# EAGLE board GETEWAY (EAGLE 9.5.1), part 1 of 2
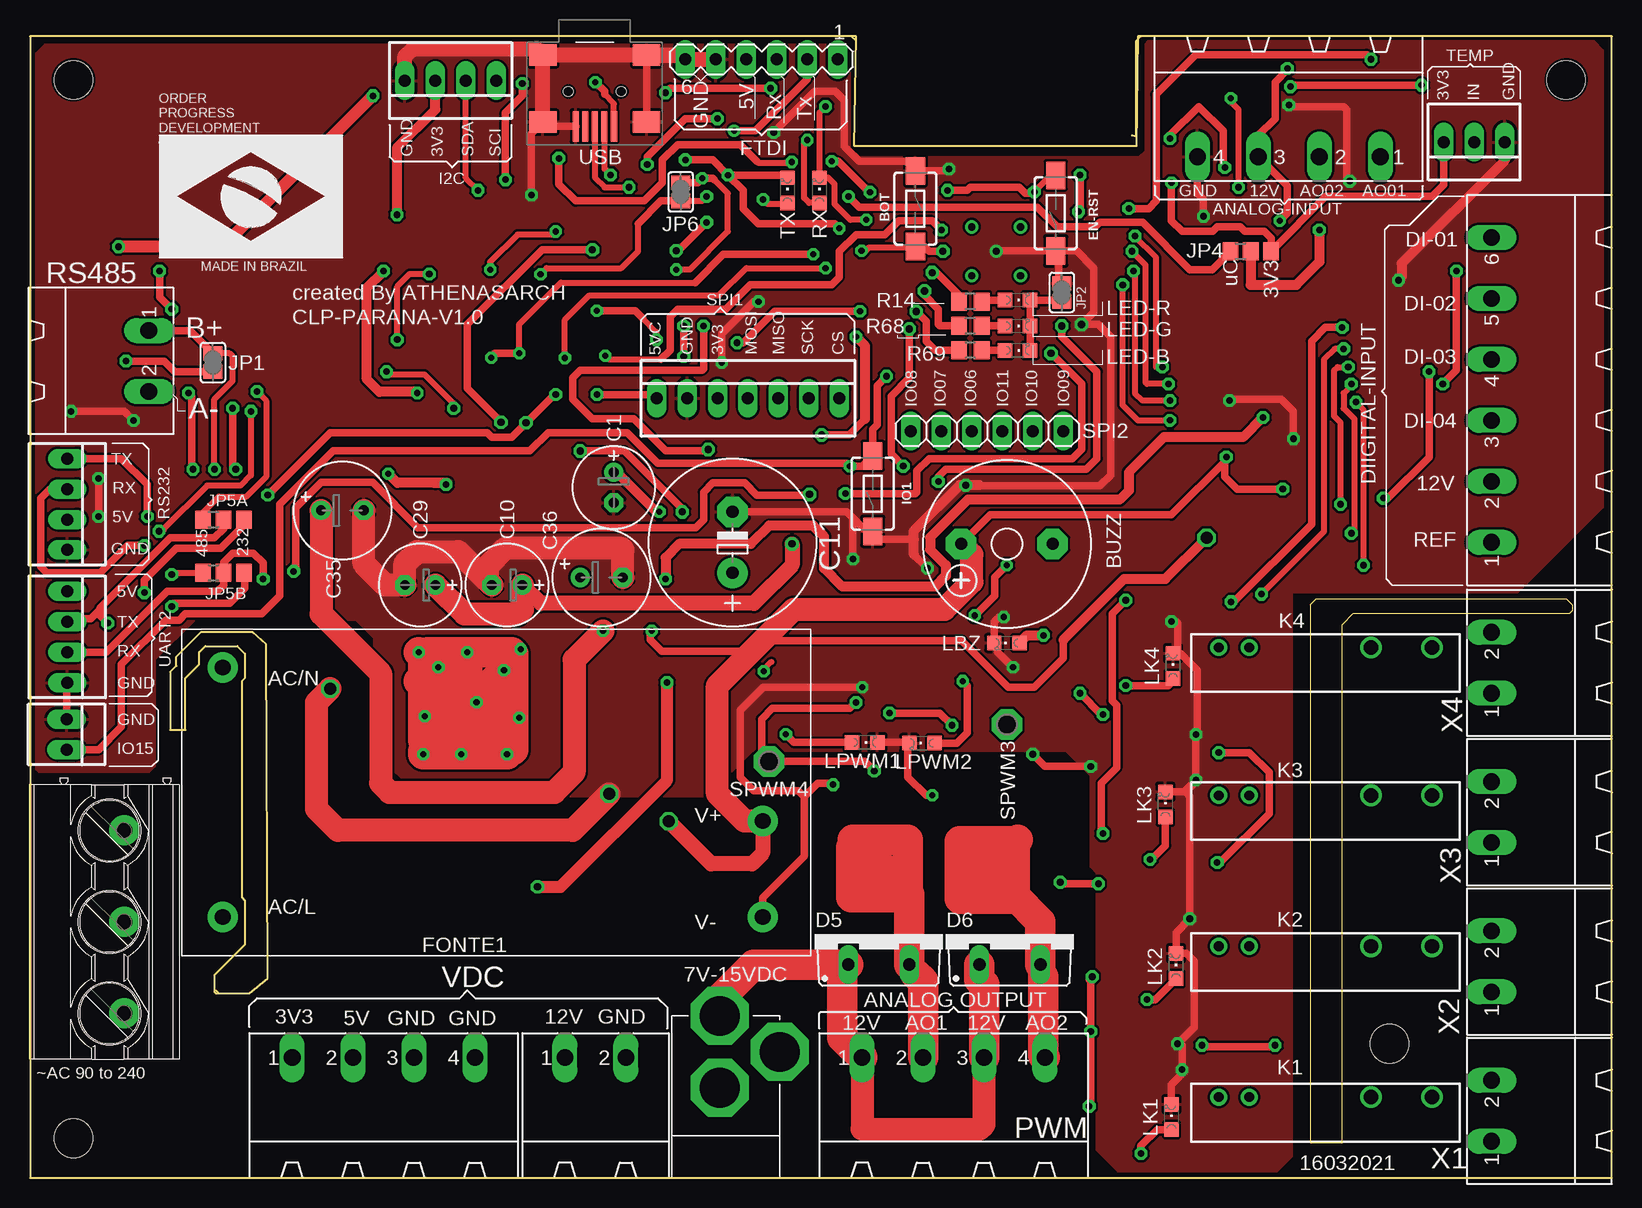
[diagram p5: board, top side]
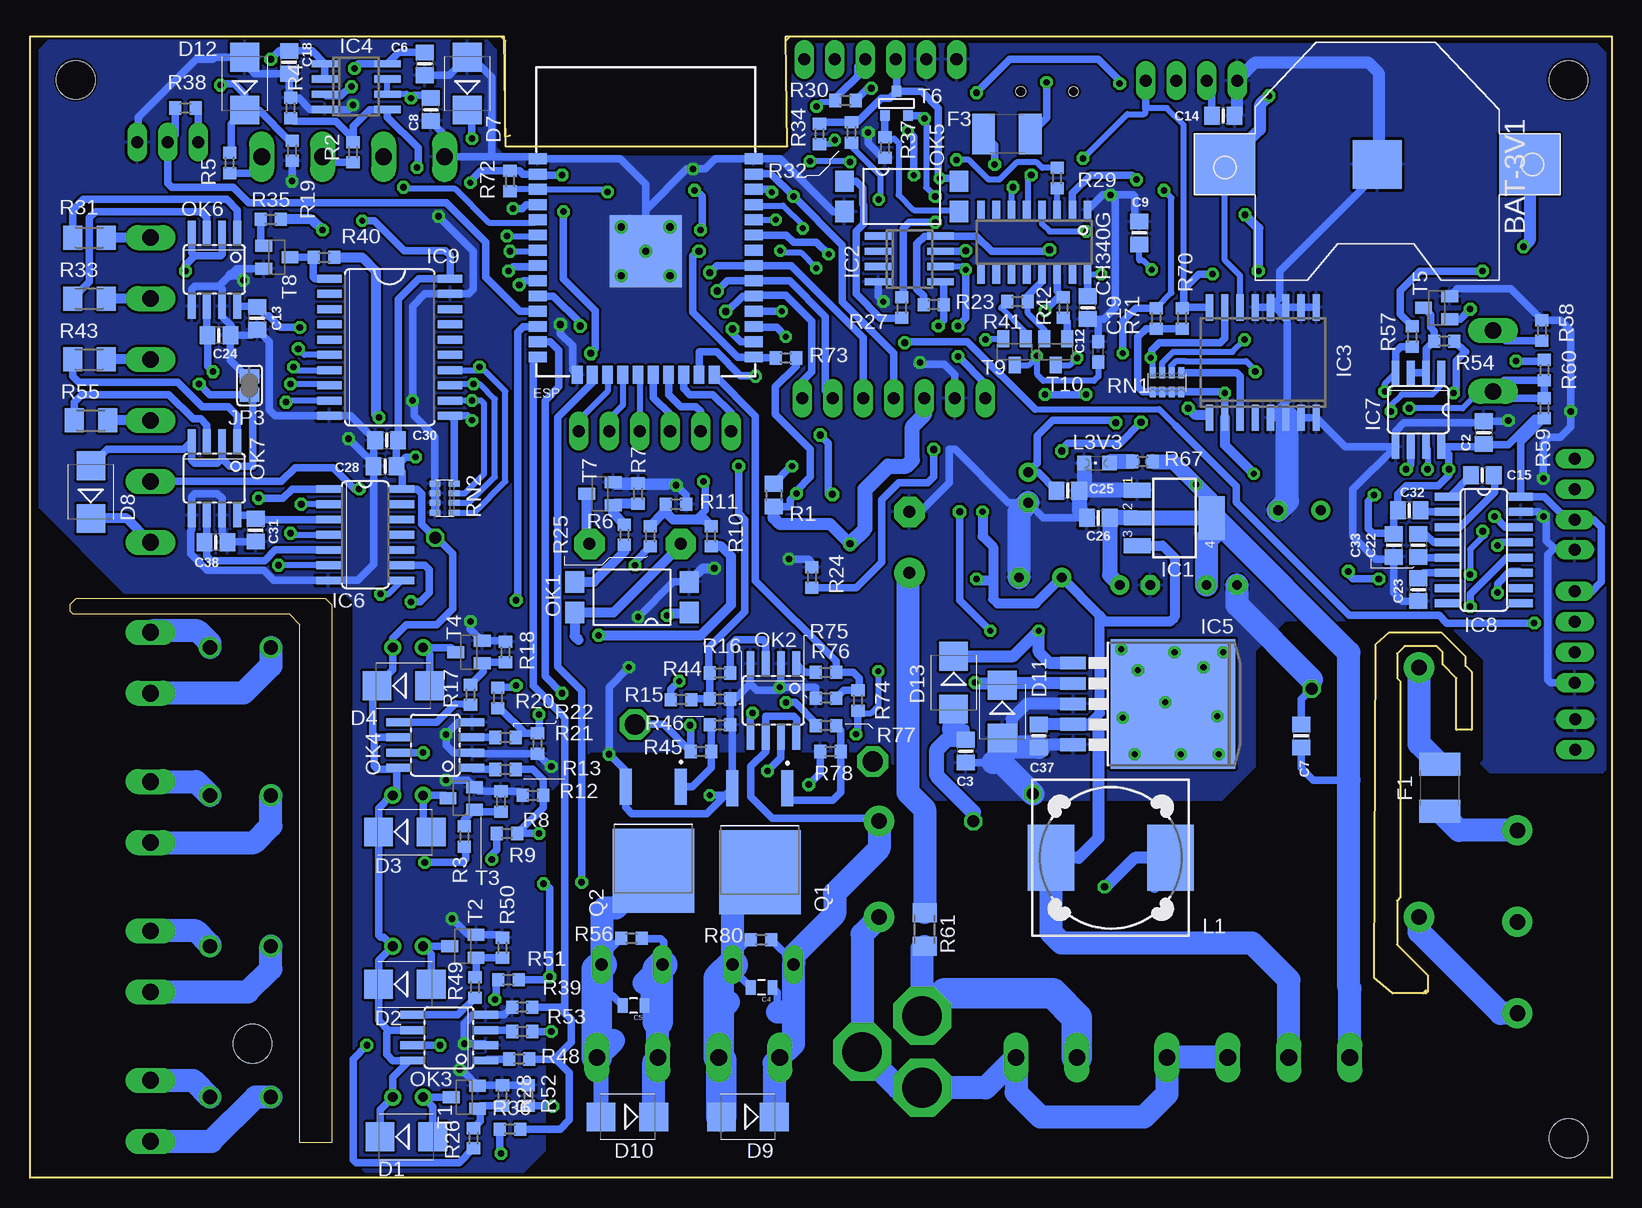
[diagram p6: board, bottom side, seen from below]

Size 131.83 x 95.12 mm. Coordinates in mm from the lower left corner, seen from the top.
Outline: 15.75,15.37 18.29,15.37 19.81,16.64 19.68,44.45 18.54,45.47 14.22,45.47 12.19,43.43 12.19,42.67 11.68,42.16 11.68,37.34 12.95,37.34 12.95,41.66 14.1,42.8 14.1,43.81 14.61,44.32 17.27,44.32 17.91,43.69 17.91,41.66 17.65,41.4 17.65,23.37 17.91,23.11 17.91,19.43 15.37,16.89 15.37,15.49 15.49,15.37 15.75,15.37
Outline: 15.49,15.62 15.75,15.37
Outline: 91.82,86.87 92.2,86.74 92.2,94.74 92.58,95.12
Outline: 68.83,94.74 68.45,95.12
Outline: 109.35,2.92 109.35,46.1 110.24,46.99 128.27,46.99 128.52,47.24 128.52,47.75 128.02,48.26 107.19,48.26 106.68,47.75 106.68,2.92 109.35,2.92
Outline: 131.83,0 131.83,95.12 92.33,95.12 92.2,85.98 68.71,85.98 68.83,95.12 0,95.12 0,0 131.83,0
Copper layers (1*16): Top 0.035mm / dielectric 1.5mm / Bottom 0.035mm
Design rules "SparkFun": minimum track width 8mil, minimum drill 20mil, track to track 8mil, track to pad 8mil, pad to pad 8mil, via to via 8mil, smd to smd 8mil, copper to edge 8mil, drill to drill 8mil, minimum pad ring 12mil, minimum via ring 10mil, stop-mask expansion 4mil, vias tented up to drill 20mil, thermal gap 10mil
Net classes: 1 power: width 0.61 mm, drill 0.406 mm, clearance 0.203 mm; 2 vcc: width 0.406 mm, drill 0.406 mm, clearance 0.254 mm
Holes 3.2 mm at 3.62,91.5 128.02,91.5 3.62,3.3 113.28,11.18

## Footprints (pad centres in the part's own frame; a part is rotated, then mirrored left to right if it is on the bottom)
DC-21MM = drill 3.302 pad 4.826 octagon: 1 -5.08,-3.353; 2 -0.076,-6.35; 3 -0.076,-0.356
MSTBA2 = drill 1.397 long: 1 -2.54,5.08; 2 2.54,5.08
MSTBA4 = drill 1.397 long: 1 -7.62,5.08; 2 -2.54,5.08; 3 2.54,5.08; 4 7.62,5.08
CR2032-SMD = smd 5.08 x 5.08: +$1 -12.7,0; +$2 12.7,0 | smd 4.064 x 4.064: - 0,0
TACTILE_SWITCH_SMD_6.0X3.5MM = smd 2.3 x 1.6: 1 -3.15,0; 2 3.15,0
F/CM12P = drill 1.016 pad 2.54 octagon: + 3.81,0; - -3.81,0
E2,5-7 = drill 0.813 pad 1.6: + -1.27,0 | drill 0.813 pad 1.6 octagon: - 1.27,0
0805-NO = smd 1.3 x 1.5: 1 -0.95,0; 2 0.95,0
0805 = smd 0.8 x 1.2: 1 -0.9,0; 2 0.9,0
E5-13 = drill 1.016 pad 2.54: + -2.54,0 | drill 1.016 pad 2.54 octagon: - 2.54,0
C0603 = smd 1.1 x 1: 1 -0.85,0; 2 0.85,0
E3,5-8 = drill 0.813 pad 1.6: + -1.778,0 | drill 0.813 pad 1.6 octagon: - 1.778,0
SMB = smd 2.4 x 2.4: A 2.2,0; C -2.2,0
DO220S = drill 1.016 long: A 2.54,-2.54; C -2.54,-2.54
MSTBA6 = drill 1.397 long: 1 -12.7,5.08; 2 -7.62,5.08; 3 -2.54,5.08; 4 2.54,5.08; 5 7.62,5.08; 6 12.7,5.08
ESP-WROOM-32 = smd 0.9 x 1.5: 1 7.7,9; 2 6.43,9; 3 5.16,9; 4 3.89,9; 5 2.62,9; 6 1.35,9; 7 0.08,9; 8 -1.19,9; 9 -2.46,9; 10 -3.73,9; 11 -5,9; 12 -6.27,9; 13 -7.54,9; 14 -8.81,9; 25 -8.81,-9; 26 -7.54,-9; 27 -6.27,-9; 28 -5,-9; 29 -3.73,-9; 30 -2.46,-9; 31 -1.19,-9; 32 0.08,-9; 33 1.35,-9; 34 2.62,-9; 35 3.89,-9; 36 5.16,-9; 37 6.43,-9; 38 7.7,-9 | smd 1.5 x 0.9: 15 -10.3,5.715; 16 -10.3,4.445; 17 -10.3,3.175; 18 -10.3,1.905; 19 -10.3,0.635; 20 -10.3,-0.635; 21 -10.3,-1.905; 22 -10.3,-3.175; 23 -10.3,-4.445; 24 -10.3,-5.715 | smd 6 x 6: GND 0,0
L1812 = smd 1.9 x 3.4: 1 -1.95,0; 2 1.95,0
IRM_15/20 = drill 1.3 pad 2.54: AC/L -22.8,-10.4; AC/N -22.8,10.4; V+ 22.2,-2.4; V- 22.2,-10.4
MA06-1 = drill 1.016 long: 1 -6.35,0; 2 -3.81,0; 3 -1.27,0; 4 1.27,0; 5 3.81,0; 6 6.35,0
22-23-2041 = drill 1 long: 1 -3.81,0; 2 -1.27,0; 3 1.27,0; 4 3.81,0
SOT223 = smd 1.219 x 2.235: 1 -2.311,-3.099; 2 0,-3.099; 3 2.311,-3.099 | smd 3.6 x 2.2: 4 0,3.099
SO08 = smd 0.6 x 2.2: 1 -1.905,-2.6; 2 -0.635,-2.6; 3 0.635,-2.6; 4 1.905,-2.6; 5 1.905,2.6; 6 0.635,2.6; 7 -0.635,2.6; 8 -1.905,2.6
SO16W = smd 0.6 x 2.2: 1 -4.445,-4.6; 2 -3.175,-4.6; 3 -1.905,-4.6; 4 -0.635,-4.6; 5 0.635,-4.6; 6 1.905,-4.6; 7 3.175,-4.6; 8 4.445,-4.6; 9 4.445,4.6; 10 3.175,4.6; 11 1.905,4.6; 12 0.635,4.6; 13 -0.635,4.6; 14 -1.905,4.6; 15 -3.175,4.6; 16 -4.445,4.6
TO263-5 = smd 1.067 x 2.159: 1 -3.404,-5.791; 2 -1.702,-5.791; 3 0,-5.791; 4 1.702,-5.791; 5 3.404,-5.791 | smd 10.8 x 10.41: 6 0,2.54
SO14 = smd 0.66 x 2.032: 1 -3.81,-3.073; 2 -2.54,-3.073; 3 -1.27,-3.073; 4 0,-3.073; 5 1.27,-3.073; 6 2.54,-3.073; 7 3.81,-3.073; 8 3.81,3.073; 9 2.54,3.073; 10 1.27,3.073; 11 0,3.073; 12 -1.27,3.073; 13 -2.54,3.073; 14 -3.81,3.073
SO08' = smd 0.66 x 2.032: 1 -1.905,-3.073; 2 -0.635,-3.073; 3 0.635,-3.073; 4 1.905,-3.073; 5 1.905,3.073; 6 0.635,3.073; 7 -0.635,3.073; 8 -1.905,3.073
SO16 = smd 0.66 x 2.032: 1 -4.445,-3.073; 2 -3.175,-3.073; 3 -1.905,-3.073; 4 -0.635,-3.073; 5 0.635,-3.073; 6 1.905,-3.073; 7 3.175,-3.073; 8 4.445,-3.073; 9 4.445,3.073; 10 3.175,3.073; 11 1.905,3.073; 12 0.635,3.073; 13 -0.635,3.073; 14 -1.905,3.073; 15 -3.175,3.073; 16 -4.445,3.073
SO20W = smd 0.66 x 2.032: 1 -5.715,-5.029; 2 -4.445,-5.029; 3 -3.175,-5.029; 4 -1.905,-5.029; 5 -0.635,-5.029; 6 0.635,-5.029; 7 1.905,-5.029; 8 3.175,-5.029; 9 4.445,-5.029; 10 5.715,-5.029; 11 5.715,5.029; 12 4.445,5.029; 13 3.175,5.029; 14 1.905,5.029; 15 0.635,5.029; 16 -0.635,5.029; 17 -1.905,5.029; 18 -3.175,5.029; 19 -4.445,5.029; 20 -5.715,5.029
22-23-2021 = drill 1 long: 1 -1.27,0; 2 1.27,0
SJ = smd 1.168 x 1.6: 1 -0.762,0; 2 0.762,0
A0R-JMP = smd 1.5 x 1.3: 1 0,1.7; 2 0,0; 3 0,-1.7
AQZ404-PS-H = drill 0.8: 1 -8.89,0; 2 -6.35,0 | drill 1.2: 5 3.81,0; 6 8.89,0
DR125 = smd 3.85 x 5.5: 1 -4.975,0; 2 4.975,0
CHIPLED_0805 = smd 1.2 x 1.2: A 0,-1.05; C 0,1.05
SMD4-7 = smd 1.78 x 1.55: 1 -1.27,-4.77; 2 1.27,-4.77; 3 1.27,4.77; 4 -1.27,4.77
SOIC08 = smd 0.66 x 2.032: 1 -1.905,-3.073; 2 -0.635,-3.073; 3 0.635,-3.073; 4 1.905,-3.073; 5 1.905,3.073; 6 0.635,3.073; 7 -0.635,3.073; 8 -1.905,3.073
TRANS_AP70T03GH-HF-3TR = smd 3 x 1: 1 -4.5,2.3; 3 -4.5,-2.3 | smd 7 x 6.8: 2 2.5,0
R0805 = smd 1.3 x 1.5: 1 -0.95,0; 2 0.95,0
R0603 = smd 1 x 1.1: 1 -0.85,0; 2 0.85,0
M1206 = smd 1.6 x 2: 1 -1.4,0; 2 1.4,0
CTS742C083 = smd 0.5 x 0.9: 1 -1.2,-0.8; 2 -0.4,-0.8; 3 0.4,-0.8; 4 1.2,-0.8; 5 1.2,0.8; 6 0.4,0.8; 7 -0.4,0.8; 8 -1.2,0.8
22-23-2071 = drill 1 long: 1 -7.62,0; 2 -5.08,0; 3 -2.54,0; 4 0,0; 5 2.54,0; 6 5.08,0; 7 7.62,0
1X06 = drill 1.016 long: 1 -6.35,0; 2 -3.81,0; 3 -1.27,0; 4 1.27,0; 5 3.81,0; 6 6.35,0
P1-17 = drill 1.702 pad 2.54 octagon: TP 0,0
SOT23-BEC = smd 1 x 1.4: B -0.95,-1.1; C 0,1.1; E 0.95,-1.1
SOT-23 = smd 0.787 x 0.889: 1 0.025,-1.016; 2 -0.94,1.016; 3 0.991,1.016
22-23-2031 = drill 1 long: 1 -2.54,0; 2 0,0; 3 2.54,0
SOIC16 = smd 0.635 x 1.524: 1 -4.445,-2.695; 2 -3.175,-2.695; 3 -1.905,-2.695; 4 -0.635,-2.695; 5 0.635,-2.695; 6 1.905,-2.695; 7 3.175,-2.695; 8 4.445,-2.695; 9 4.445,2.695; 10 3.175,2.695; 11 1.905,2.695; 12 0.635,2.695; 13 -0.635,2.695; 14 -1.905,2.695; 15 -3.175,2.695; 16 -4.445,2.695
USB-MINI-B_2 = smd 0.508 x 2.54: 1 0,0; 2 0.8,0; 3 1.6,0; 4 2.4,0; 5 3.2,0 | smd 2.286 x 1.778: 6 -2.717,5.948; 7 -2.717,0.36; 8 5.918,0.36; 9 5.918,5.948 | hole 0.813: -0.6,2.9; 3.8,2.9
MKDS_5/3-762 = drill 1.3 pad 2.5: 1 -7.62,0; 2 0,0; 3 7.62,0

## Placement (x,y rotation side)
7V-15VDC  DC21MMX  [DC-21MM]  57.4,7.15 180 top
12V  MSTBA2  [MSTBA2]  47.12,4.95 0 top
ANALOG-INPUT  MSTBA4  [MSTBA4]  104.9,90.17 180 top
BAT-3V1  3v  [CR2032-SMD]  19.56,84.45 180 bottom
BOT  CH01  [TACTILE_SWITCH_SMD_6.0X3.5MM]  73.79,80.77 270 top
BUZZ  F/CM12P  [F/CM12P]  81.41,52.83 180 top
C1  100uF  [E2,5-7]  48.64,57.53 270 top
C2  100nF  [0805-NO]  10.67,62.1 270 bottom
C3  100nF  [0805-NO]  53.85,35.56 90 bottom
C4  104  [0805]  70.87,15.88 180 bottom
C5  104  [0805]  81.53,14.35 180 bottom
C6  100nF  [0805-NO]  98.93,92.84 270 bottom
C7  100nF  [0805-NO]  25.91,36.83 270 bottom
C8  100nF  [0805-NO]  98.42,89.03 90 bottom
C9  100nF  [0805-NO]  39.37,78.74 270 bottom
C10  100uF  [E2,5-7]  39.75,49.4 180 top
C11  2200uF/25v  [E5-13]  58.55,52.96 90 top
C12  100nF  [0805-NO]  43.69,72.52 90 bottom
C13  100nF  [0805-NO]  112.9,71.63 90 bottom
C14  100nF  [0805-NO]  32.38,88.52 180 bottom
C15  100nF  [0805-NO]  10.79,58.55 0 bottom
C18  100nF  [0805-NO]  110.24,92.96 90 bottom
C19  100nF  [C0603]  42.8,68.83 90 bottom
C22  100nF  [0805-NO]  16.13,52.7 270 bottom
C23  100nF  [0805-NO]  16.13,49.02 90 bottom
C24  100nF  [0805-NO]  116.08,70.23 180 bottom
C25  100nF  [0805-NO]  45.34,57.28 180 bottom
C26  100nF  [0805-NO]  42.8,54.99 0 bottom
C28  100nF  [0805-NO]  102.23,59.31 0 bottom
C29  100uF  [E2,5-7]  32.51,49.4 180 top
C30  100nF  [0805-NO]  102.11,61.47 0 bottom
C31  100nF  [0805-NO]  113.03,53.98 90 bottom
C32  100nF  [0805-NO]  16.89,55.63 180 bottom
C33  100nF  [0805-NO]  18.16,52.7 270 bottom
C35  100uF/50v  [E3,5-8]  26.04,55.63 0 top
C36  330uF/25v  [E3,5-8]  47.62,50.04 0 top
C37  100nF  [0805-NO]  47.75,36.83 90 bottom
C38  100nF  [0805-NO]  116.33,52.96 180 bottom
D1  M7  [SMB]  100.46,3.43 0 bottom
D2  M7  [SMB]  100.58,16.13 0 bottom
D3  M7  [SMB]  100.58,28.83 0 bottom
D4  M7  [SMB]  100.71,41.02 0 bottom
D5  FES08AT  [DO220S]  70.74,20.32 0 top
D6  FES08AT  [DO220S]  81.66,20.32 0 top
D7  3v3  [SMB]  95.38,91.19 90 bottom
D8  M7  [SMB]  126.75,57.15 90 bottom
D9  M7  [SMB]  72.01,5.08 180 bottom
D10  M7  [SMB]  82.04,5.08 180 bottom
D11  SS510  [SMB]  50.8,38.86 270 bottom
D12  3v3  [SMB]  113.92,91.19 90 bottom
D13  M7  [SMB]  54.86,41.27 270 bottom
DIIGITAL-INPUT  MSTBA6  [MSTBA6]  126.87,65.66 90 top
EN-RST  CH01  [TACTILE_SWITCH_SMD_6.0X3.5MM]  85.47,80.39 90 top
ESP  ESP-WROOM-32  [ESP-WROOM-32]  80.52,77.22 90 bottom
F1  500mA  [L1812]  14.35,32.51 270 bottom
F3  500mA  [L1812]  50.42,87 180 bottom
FONTE1  IRM-15/20-12  [IRM_15/20]  38.86,32.13 0 top
FTDI  [MA06-1]  60.96,93.22 180 top
I2C  22-23-2041  [22-23-2041]  35.05,91.44 180 top
IC1  AMS1117-3.3v  [SOT223]  36.45,54.99 270 bottom
IC2  LM358D  [SO08]  58.55,76.58 270 bottom
IC3  DS3231/SO  [SO16W]  29.08,67.94 0 bottom
IC4  LM358D  [SO08]  104.65,90.93 270 bottom
IC5  LM2576 5V  [TO263-5]  39.12,39.5 270 bottom
IC6  74HC14D  [SO14]  103.89,53.59 270 bottom
IC7  MAX485 SMD  [SO08']  16.13,64.01 180 bottom
IC8  MAX3232 SMD  [SO16]  10.67,52.32 270 bottom
IC9  74HC541DW  [SO20W]  101.85,69.22 270 bottom
IO1  CH02  [TACTILE_SWITCH_SMD_6.0X3.5MM]  70.23,57.02 90 top
IO15  22-23-2021  [22-23-2021]  3.05,36.96 270 top
JP1  [SJ]  15.24,67.94 270 top
JP2  [SJ]  85.98,73.79 270 top
JP3  [SJ]  113.54,66.04 270 bottom
JP4  0R-JUMPA  [A0R-JMP]  101.73,77.22 90 top
JP5A  0R-JUMPA  [A0R-JMP]  16.13,54.86 90 top
JP5B  0R-JUMPA  [A0R-JMP]  16.13,50.42 90 top
JP6  [SJ]  54.23,82.17 90 top
K1  AQZ404-PS-H  [AQZ404-PS-H]  107.95,6.73 0 top
K2  AQZ404-PS-H  [AQZ404-PS-H]  107.95,19.3 0 top
K3  AQZ404-PS-H  [AQZ404-PS-H]  107.95,31.88 0 top
K4  AQZ404-PS-H  [AQZ404-PS-H]  107.95,44.2 0 top
L1  100uH  [DR125]  41.76,26.67 180 bottom
L3V3  LED1  [CHIPLED_0805]  42.93,59.56 90 bottom
LBZ  RED  [CHIPLED_0805]  81.41,44.58 90 top
LED-B  LED4  [CHIPLED_0805]  82.3,68.96 270 top
LED-G  LED3  [CHIPLED_0805]  82.3,70.99 270 top
LED-R  LED2  [CHIPLED_0805]  82.3,73.15 270 top
LK1  GREEN  [CHIPLED_0805]  95.12,5.08 0 top
LK2  GREEN  [CHIPLED_0805]  95.5,17.65 0 top
LK3  GREEN  [CHIPLED_0805]  94.61,31.11 0 top
LK4  GREEN  [CHIPLED_0805]  95.25,42.67 0 top
LPWM1  BLUE  [CHIPLED_0805]  69.57,36.29 270 top
LPWM2  BLUE  [CHIPLED_0805]  74.33,36.23 90 top
OK1  817C  [SMD4-7]  81.66,48.39 90 bottom
OK2  ILD207  [SOIC08]  69.88,39.78 180 bottom
OK3  ILD207  [SOIC08]  96.9,11.68 90 bottom
OK4  ILD207  [SOIC08]  98.04,36.07 90 bottom
OK5  817C  [SMD4-7]  59.18,81.79 270 bottom
OK6  ILD207  [SOIC08]  116.46,75.69 180 bottom
OK7  ILD207  [SOIC08]  116.46,58.29 180 bottom
PWM  MSTBA4  [MSTBA4]  76.96,4.95 0 top
Q1  60N03  [TRANS_AP70T03GH-HF-3TR]  71,27.97 270 bottom
Q2  60N03  [TRANS_AP70T03GH-HF-3TR]  79.88,28.08 270 bottom
R1  1K  [R0805]  69.85,56.9 270 bottom
R2  30K  [R0603]  104.9,85.47 90 bottom
R3  510  [R0603]  95.63,28.45 270 bottom
R4  10k  [R0603]  110.11,89.15 270 bottom
R5  30K  [R0603]  115.19,84.58 90 bottom
R6  510  [R0603]  82.3,53.59 270 bottom
R7  no  [R0603]  81.15,57.02 90 bottom
R8  no  [R0603]  92.58,31.37 90 bottom
R9  220  [R0603]  92.08,28.7 0 bottom
R10  220  [R0603]  75.06,53.47 90 bottom
R11  10k  [R0603]  77.98,56.13 180 bottom
R12  10k  [R0603]  89.92,31.88 0 bottom
R13  220  [R0603]  92.2,34.04 0 bottom
R14  1K  [R0805]  78.36,73.03 180 top
R15  220  [R0603]  77.57,39.85 0 bottom
R16  10k  [R0603]  74.33,39.91 180 bottom
R17  510  [R0603]  95.12,40.26 270 bottom
R18  no  [R0603]  92.2,43.81 90 bottom
R19  10k  [R0603]  109.98,85.6 90 bottom
R20  220  [R0603]  92.84,40.01 270 bottom
R21  10k  [R0603]  89.53,36.2 90 bottom
R22  220  [R0603]  92.2,36.7 0 bottom
R23  1k5  [R0603]  56.52,72.77 0 bottom
R24  10k  [R0603]  66.67,50.04 270 bottom
R25  220  [R0603]  80.14,53.47 90 bottom
R26  510  [R0603]  94.87,3.3 270 bottom
R27  1k  [R0603]  59.18,72.52 90 bottom
R28  no  [R0603]  92.46,6.86 90 bottom
R29  1k  [R0603]  46.23,83.31 270 bottom
R30  1k  [R0603]  63.88,89.79 0 bottom
R31  10K  [M1206]  126.87,78.36 180 bottom
R32  1k  [R0603]  63.37,87.12 270 bottom
R33  10K  [M1206]  126.87,73.28 180 bottom
R34  1k  [R0603]  66.04,87 270 bottom
R35  1k  [R0603]  111.76,79.88 0 bottom
R36  220  [R0603]  91.82,4.06 0 bottom
R37  1k  [R0603]  60.58,85.85 270 bottom
R38  4k7  [R0603]  118.87,89.15 0 bottom
R39  10k  [R0603]  90.81,14.22 0 bottom
R40  10k  [R0603]  107.31,76.71 0 bottom
R41  1k  [R0603]  49.53,73.03 180 bottom
R42  1k  [R0603]  45.72,72.52 270 bottom
R43  10K  [M1206]  126.87,68.2 180 bottom
R44  220  [R0603]  74.33,42.07 180 bottom
R45  100  [R0603]  75.92,35.53 180 bottom
R46  10k  [R0603]  74.33,37.75 0 bottom
R48  220  [R0603]  91.06,9.91 0 bottom
R49  510  [R0603]  94.74,15.88 270 bottom
R50  no  [R0603]  92.46,19.18 90 bottom
R51  220  [R0603]  91.95,16.51 0 bottom
R52  10k  [R0603]  90.3,6.86 270 bottom
R53  220  [R0603]  90.81,12.19 0 bottom
R54  10k  [R0603]  13.97,69.72 180 bottom
R55  10K  [M1206]  126.75,63.12 180 bottom
R56  10k  [R0603]  81.69,19.97 180 bottom
R57  1k  [R0603]  16.64,70.1 90 bottom
R58  4k7  [R0603]  5.84,70.61 90 bottom
R59  4k7  [R0603]  5.63,64.14 90 bottom
R60  120  [R0603]  5.63,67.31 90 bottom
R61  470  [M1206]  57.28,20.7 270 bottom
R67  470  [R0603]  39.12,59.69 0 bottom
R68  1K  [R0805]  78.36,70.99 180 top
R69  1K  [R0805]  78.36,68.96 180 top
R70  10k  [R0603]  35.81,71.63 90 bottom
R71  10k  [R0603]  37.97,71.63 90 bottom
R72  10k  [R0603]  91.82,83.06 270 bottom
R73  10k  [R0603]  68.83,68.33 0 bottom
R74  220  [R0603]  62.83,39.78 90 bottom
R75  10k  [R0603]  65.5,39.97 0 bottom
R76  220  [R0603]  65.5,42.13 0 bottom
R77  100  [R0603]  65.5,37.69 180 bottom
R78  10k  [R0603]  65.12,35.53 180 bottom
R80  10k  [R0603]  70.9,19.84 180 bottom
RN1  CTS742C083  [CTS742C083]  37.08,66.29 180 bottom
RN2  CTS742C083  [CTS742C083]  97.28,56.64 90 bottom
RS232  22-23-2041  [22-23-2041]  3.1,56.13 270 top
RS485  MSTBA2  [MSTBA2]  4.83,68.07 270 top
RX  RED  [CHIPLED_0805]  65.79,82.3 0 top
SPI1  22-23-2071  [22-23-2071]  59.83,64.96 0 top
SPI2  [1X06]  79.76,62.23 0 top
SPWM3  PTR1PAD1-17  [P1-17]  81.41,37.78 90 top
SPWM4  PTR1PAD1-17  [P1-17]  61.59,34.7 90 top
T1  bc848 sot23  [SOT23-BEC]  95.63,6.73 90 bottom
T2  bc848 sot23  [SOT23-BEC]  95.76,19.3 90 bottom
T3  bc848 sot23  [SOT23-BEC]  95.89,31.62 90 bottom
T4  bc848 sot23  [SOT23-BEC]  95.25,43.81 90 bottom
T5  bc848 sot23  [SOT23-BEC]  14.61,72.52 90 bottom
T6  FDN340P  [SOT-23]  59.59,89.53 180 bottom
T7  bc848 sot23  [SOT23-BEC]  84.33,57.02 90 bottom
T8  bc848 sot23  [SOT23-BEC]  111.25,76.71 270 bottom
T9  bc848 sot23  [SOT23-BEC]  49.78,68.83 180 bottom
T10  bc848 sot23  [SOT23-BEC]  46.35,68.83 180 bottom
TEMP  22-23-2031  [22-23-2031]  120.34,86.32 180 top
TX  RED  [CHIPLED_0805]  63.12,82.3 0 top
U2  CH340G  [SOIC16]  48.13,77.98 180 bottom
UART2  22-23-2041  [22-23-2041]  3.1,45.09 270 top
USB  USB-MINI-B%C  [USB-MINI-B_2]  45.47,87.63 0 top
VDC  MSTBA4  [MSTBA4]  29.46,4.95 0 top
X0-VCA  MKDS_5/3-7,62  [MKDS_5/3-762]  7.87,21.34 270 top
X1  MSTBA2  [MSTBA2]  126.87,5.59 90 top
X2  MSTBA2  [MSTBA2]  126.87,18.03 90 top
X3  MSTBA2  [MSTBA2]  126.87,30.48 90 top
X4  MSTBA2  [MSTBA2]  126.87,42.93 90 top